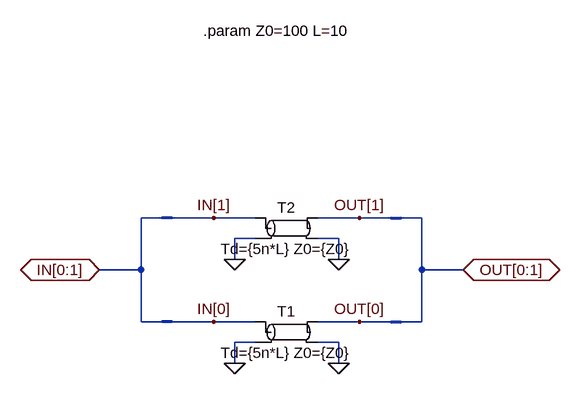
[diagram p0: schematic bus_line.asc]
bus_line.asc, the LTspice schematic file:
Version 4
SHEET 1 880 680
WIRE 32 0 0 0
WIRE 112 0 48 0
WIRE 176 0 112 0
WIRE 336 0 272 0
WIRE 384 0 336 0
WIRE 432 0 400 0
WIRE 176 32 144 32
WIRE 304 32 272 32
WIRE 144 64 144 32
WIRE 304 64 304 32
WIRE 0 80 0 0
WIRE 0 80 -64 80
WIRE 432 80 432 0
WIRE 496 80 432 80
WIRE 0 160 0 80
WIRE 32 160 0 160
WIRE 112 160 48 160
WIRE 176 160 112 160
WIRE 336 160 272 160
WIRE 384 160 336 160
WIRE 432 160 432 80
WIRE 432 160 400 160
WIRE 176 192 144 192
WIRE 304 192 272 192
WIRE 144 224 144 192
WIRE 304 224 304 192
FLAG 144 224 0
FLAG 304 224 0
FLAG 144 64 0
FLAG 304 64 0
FLAG -64 80 IN[0:1]
IOPIN -64 80 BiDir
FLAG 496 80 OUT[0:1]
IOPIN 496 80 BiDir
FLAG 336 160 OUT[0]
FLAG 336 0 OUT[1]
FLAG 112 160 IN[0]
FLAG 112 0 IN[1]
BUSTAP 384 160 400 160
BUSTAP 48 160 32 160
BUSTAP 384 0 400 0
BUSTAP 48 0 32 0
SYMBOL tline 224 176 R0
SYMATTR InstName T1
SYMATTR Value Td={5n*L} Z0={Z0}
SYMBOL tline 224 16 R0
SYMATTR InstName T2
SYMATTR Value Td={5n*L} Z0={Z0}
TEXT 96 -288 Left 2 !.param Z0=100 L=10

The netlist it stands for:
* bus_line.asc
T1 IN[0] 0 OUT[0] 0 Td={5n*L} Z0={Z0}
T2 IN[1] 0 OUT[1] 0 Td={5n*L} Z0={Z0}
.param Z0=100 L=10
.backanno
.end